# Altium schematic sheet PCB_Dpad&Trigger.SchDoc
size A4; SheetNumber: 1; SheetTotal: 1
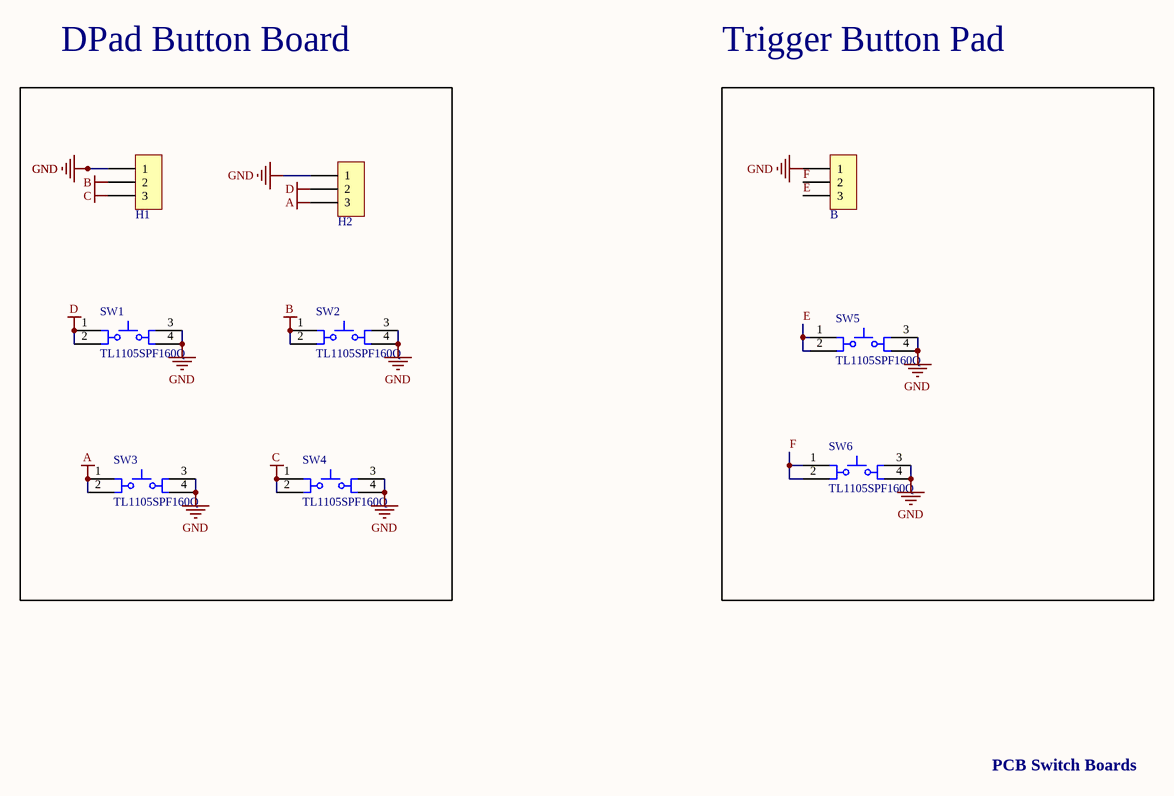
[diagram p0: PCB_Dpad&Trigger.SchDoc]

## Parts
B  HDR,2.54mm,1x3  [HEADER_2.54MM_1x3PIN]  (value not drawn)  (no BOM)
H1  HDR,2.54mm,1x3  [HEADER_2.54MM_1x3PIN]  (value not drawn)  (no BOM)
H2  HDR,2.54mm,1x3  [HEADER_2.54MM_1x3PIN]  (value not drawn)  (no BOM)
SW1  TL1105SPF160Q  [ESWI-TL1105SPF_V]
SW2  TL1105SPF160Q  [ESWI-TL1105SPF_V]
SW3  TL1105SPF160Q  [ESWI-TL1105SPF_V]
SW4  TL1105SPF160Q  [ESWI-TL1105SPF_V]
SW5  TL1105SPF160Q  [ESWI-TL1105SPF_V]
SW6  TL1105SPF160Q  [ESWI-TL1105SPF_V]

## Nets
A: H2.3 SW3.1 SW3.2
B: H1.2 SW2.1 SW2.2
C: H1.3 SW4.1 SW4.2
D: H2.2 SW1.1 SW1.2
GND: B.1 H1.1 H2.1 SW1.3 SW1.4 SW2.3 SW2.4 SW3.3 SW3.4 SW4.3 SW4.4 SW5.3 SW5.4 SW6.3 SW6.4
E: B.3 SW5.1 SW5.2
F: B.2 SW6.1 SW6.2

## Notes on the sheet
- DPad Button Board
- Trigger Button Pad
- PCB Switch Boards

## Library data of the parts
B H1 H2 = HDR,2.54mm,1x3: Connector - 2.54mm, 1x3-pin
SW1-SW6 = CMP-2000-07248-1: Tact Switch, SPST-NO, 50 mA, 12 VDC, -20 to 70 degC, 4-Pin THD, RoHS, Bulk; Manufacturer: E-Switch; Actuation Force: 1.6N; Actuator Style: RoundButton; Package URL: http://spec_sheets.e-switch.com/specs/P010201.pdf; Contact Material: Silver; Size: 6x6mm; Manufacturer URL: http://www.e-switch.ch/en/; Datasheet Version: 12/2013; Package Description: 4-Pin Through Hole Device, Body 6 x 6 mm; Datasheet URL: https://www.e-switch.com/system/asset/product_line/data_sheet/140/TL1105.pdf; Termination Style: RightAngle; Package Reference: TL1105SPF; Mounting Technology: ThroughHole